# Altium schematic sheet 6_Radio.SchDoc
size A
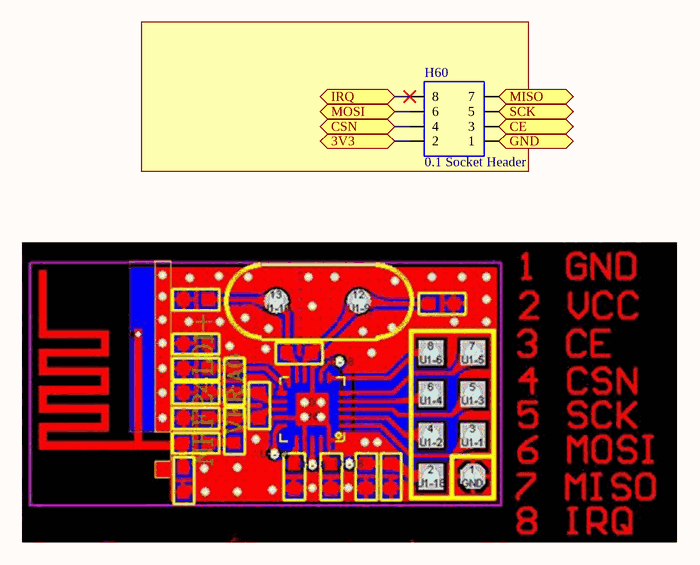
[diagram p0: 6_Radio.SchDoc]

## Parts
H60  0.1 Socket Header  [HDR-0.1-4x2]

## Ports
3V3, CE, CSN, GND, IRQ, MISO, MOSI, SCK

## Nets
3V3: H60.2 ; port 3V3
CE: H60.3 ; port CE
CSN: H60.4 ; port CSN
GND: H60.1 ; port GND
IRQ: H60.8 ; port IRQ
MISO: H60.7 ; port MISO
MOSI: H60.6 ; port MOSI
SCK: H60.5 ; port SCK

## Library data of the parts
H60 = 9897: Connector 4x2 way; Part Field 1: CONN8 15X1 2.54mm Socket Header, Gold, RoHS; Manufacturer: Sullins; PartNumber: PPPC042LFBN-RC; IPN: 9897; Characteristics: I=3A -40..105C 250V; Lead_Process_Compatible: Yes; SubmittedBy: zmze; DeviceRank: 2; Part Field 2: Sullins PPPC042LFBN-RC; ComponentLink1Description: Sullins_PPPC042LFBN-RC_Sullins_PPTC151LFBN-RC_78_P(N)PxCxxxLFBN-RC,_10492-H.pdf; ComponentLink2Description: Compliant; ComponentLink1URL: http://ecad.vsl.com.au/apps/BomGen/Data/rel/datasheets/Sullins/Sullins_PPPC042LFBN-RC_Sullins_PPTC151LFBN-RC_78_P(N)PxCxxxLFBN-RC,_10492-H.pdf; Altium_Comment_Old: CONN8 15X1 2.54mm Socket Header, Gold, RoHS; Altium_Comment: 0.1 Socket Header; Symbol: CONN8-4X2; LastChanged: 09/08/16 09:50:21; Supplier1: Digikey; Supplier1_PartNumber: S7107-ND; IPN_Search: 9897; OrderNumber: PPPC042LFBN-RC; PartType: PCB